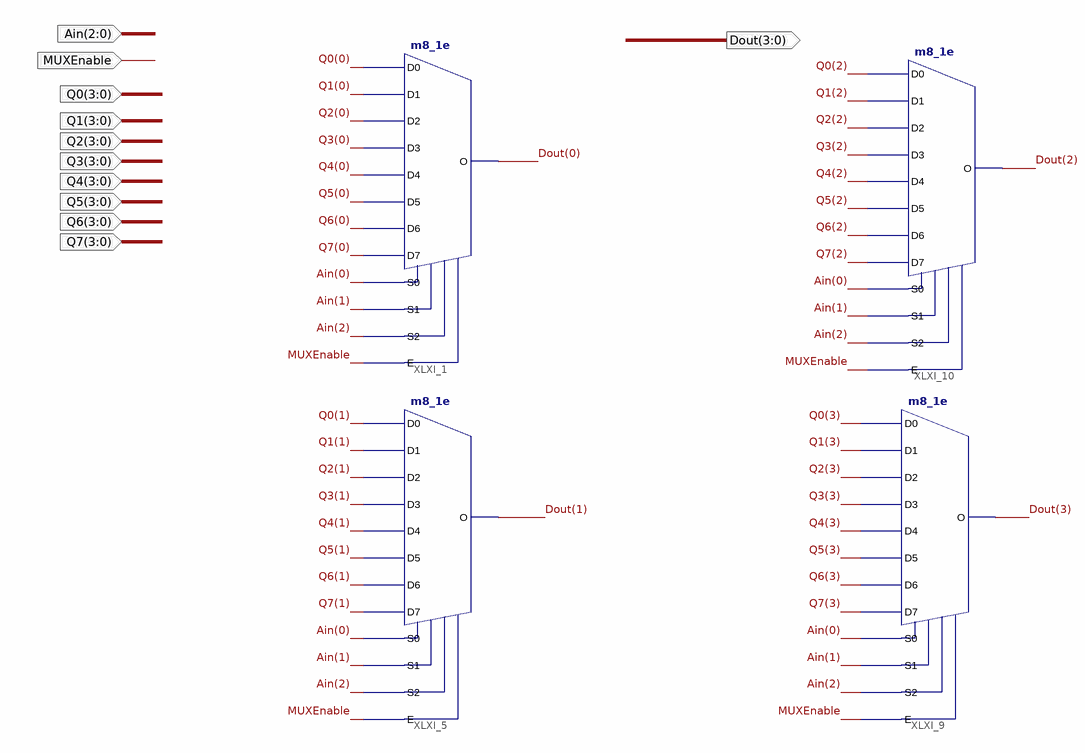
[diagram p0: schematic sheet 1]
// Xilinx ISE schematic MUXLIFE.sch (spartan3e) as structural Verilog: 4 symbols, 11 ports
module MUXLIFE (
  input  [2:0] Ain,
  input  MUXEnable,
  input  [3:0] Q0,
  input  [3:0] Q1,
  input  [3:0] Q2,
  input  [3:0] Q3,
  input  [3:0] Q4,
  input  [3:0] Q5,
  input  [3:0] Q6,
  input  [3:0] Q7,
  output [3:0] Dout
);

  m8_1e XLXI_1 (
    .D0(Q0[0]), .D1(Q1[0]), .D2(Q2[0]), .D3(Q3[0]), .D4(Q4[0]), .D5(Q5[0]), .D6(Q6[0]), .D7(Q7[0]),
    .E(MUXEnable), .S0(Ain[0]), .S1(Ain[1]), .S2(Ain[2]), .O(Dout[0]));
  m8_1e XLXI_5 (
    .D0(Q0[1]), .D1(Q1[1]), .D2(Q2[1]), .D3(Q3[1]), .D4(Q4[1]), .D5(Q5[1]), .D6(Q6[1]), .D7(Q7[1]),
    .E(MUXEnable), .S0(Ain[0]), .S1(Ain[1]), .S2(Ain[2]), .O(Dout[1]));
  m8_1e XLXI_9 (
    .D0(Q0[3]), .D1(Q1[3]), .D2(Q2[3]), .D3(Q3[3]), .D4(Q4[3]), .D5(Q5[3]), .D6(Q6[3]), .D7(Q7[3]),
    .E(MUXEnable), .S0(Ain[0]), .S1(Ain[1]), .S2(Ain[2]), .O(Dout[3]));
  m8_1e XLXI_10 (
    .D0(Q0[2]), .D1(Q1[2]), .D2(Q2[2]), .D3(Q3[2]), .D4(Q4[2]), .D5(Q5[2]), .D6(Q6[2]), .D7(Q7[2]),
    .E(MUXEnable), .S0(Ain[0]), .S1(Ain[1]), .S2(Ain[2]), .O(Dout[2]));
endmodule
